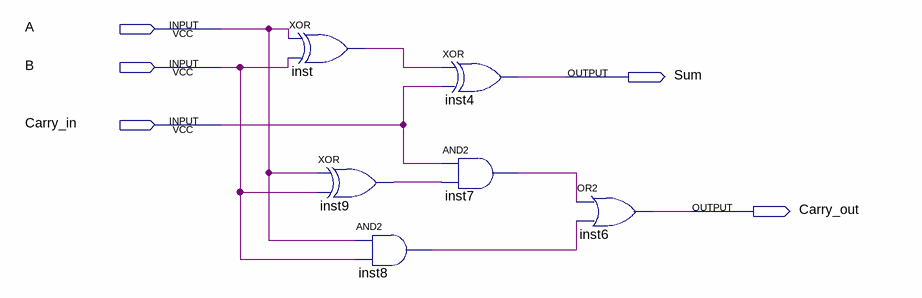
[diagram p0: schematic sheet]
// Quartus schematic full_adder.bdf as structural Verilog: 6 symbols, 5 pins
module full_adder (
  input  A,
  input  B,
  input  Carry_in,
  output Sum,
  output Carry_out
);

  wire inst7_out, inst8_out, inst9_out, inst_out;

  xor inst (inst_out, A, B);
  xor inst9 (inst9_out, A, B);
  and inst8 (inst8_out, A, B);
  xor inst4 (Sum, inst_out, Carry_in);
  and inst7 (inst7_out, Carry_in, inst9_out);
  or inst6 (Carry_out, inst7_out, inst8_out);
endmodule
